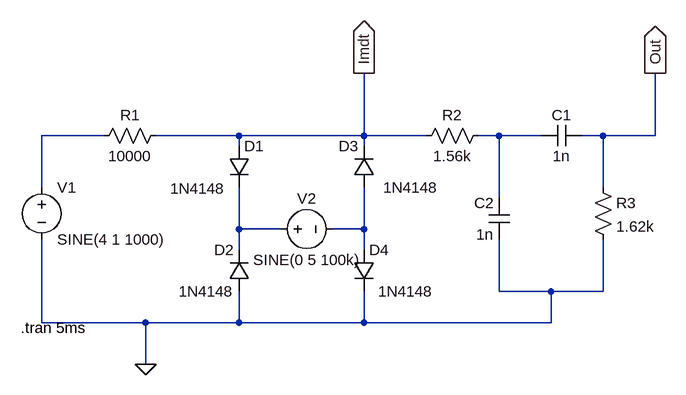
[diagram p0: schematic q1_3.asc]
q1_3.asc, the LTspice schematic file:
Version 4
SHEET 1 976 680
WIRE 48 48 -48 48
WIRE 256 48 128 48
WIRE 448 48 448 -48
WIRE 448 48 256 48
WIRE 544 48 448 48
WIRE 656 48 624 48
WIRE 720 48 656 48
WIRE 816 48 784 48
WIRE 896 48 896 -48
WIRE 896 48 816 48
WIRE 256 64 256 48
WIRE 448 64 448 48
WIRE -48 128 -48 48
WIRE 816 128 816 48
WIRE 656 144 656 48
WIRE 256 192 256 128
WIRE 320 192 256 192
WIRE 448 192 448 128
WIRE 448 192 400 192
WIRE 256 224 256 192
WIRE 448 224 448 192
WIRE 656 288 656 208
WIRE 736 288 656 288
WIRE 816 288 816 208
WIRE 816 288 736 288
WIRE -48 336 -48 208
WIRE 112 336 -48 336
WIRE 256 336 256 288
WIRE 256 336 112 336
WIRE 448 336 448 288
WIRE 448 336 256 336
WIRE 736 336 736 288
WIRE 736 336 448 336
WIRE 112 400 112 336
FLAG 896 -48 Out
IOPIN 896 -48 Out
FLAG 112 400 0
FLAG 448 -48 Imdt
IOPIN 448 -48 Out
SYMBOL voltage -48 112 R0
WINDOW 123 24 124 Left 2
WINDOW 39 0 0 Left 0
SYMATTR InstName V1
SYMATTR Value SINE(4 1 1000)
SYMBOL res 144 32 R90
WINDOW 0 0 56 VBottom 2
WINDOW 3 32 56 VTop 2
SYMATTR InstName R1
SYMATTR Value 10000
SYMBOL diode 240 64 R0
WINDOW 3 -90 65 Left 2
SYMATTR Value 1N4148
SYMATTR InstName D1
SYMBOL diode 272 288 R180
WINDOW 0 24 64 Left 2
WINDOW 3 24 0 Left 2
SYMATTR InstName D2
SYMATTR Value 1N4148
SYMBOL diode 464 128 R180
WINDOW 0 24 64 Left 2
WINDOW 3 -98 0 Left 2
SYMATTR InstName D3
SYMATTR Value 1N4148
SYMBOL diode 432 224 R0
WINDOW 3 38 64 Left 2
SYMATTR Value 1N4148
SYMATTR InstName D4
SYMBOL voltage 304 192 R270
WINDOW 0 32 56 VTop 2
WINDOW 3 -32 56 VBottom 2
WINDOW 123 0 0 Left 0
WINDOW 39 0 0 Left 0
SYMATTR InstName V2
SYMATTR Value SINE(0 5 100k)
SYMBOL res 640 32 R90
WINDOW 0 0 56 VBottom 2
WINDOW 3 32 56 VTop 2
SYMATTR InstName R2
SYMATTR Value 1.56k
SYMBOL res 800 112 R0
SYMATTR InstName R3
SYMATTR Value 1.62k
SYMBOL cap 672 208 R180
WINDOW 0 24 56 Left 2
WINDOW 3 24 8 Left 2
SYMATTR InstName C2
SYMATTR Value 1n
SYMBOL cap 784 32 R90
WINDOW 0 0 32 VBottom 2
WINDOW 3 32 32 VTop 2
SYMATTR InstName C1
SYMATTR Value 1n
TEXT -80 344 Left 2 !.tran 5ms

The netlist it stands for:
* q1_3.asc
V1 N001 0 SINE(4 1 1000)
R1 Imdt N001 10000
D1 Imdt N003 1N4148
D2 0 N003 1N4148
D3 N004 Imdt 1N4148
D4 N004 0 1N4148
V2 N003 N004 SINE(0 5 100k)
R2 N002 Imdt 1.56k
R3 Out 0 1.62k
C2 0 N002 1n
C1 Out N002 1n
.model D D
.lib standard.dio
.tran 5ms
.backanno
.end